# Altium schematic sheet park-contor-12i.SchDoc
size A3; SPICEModelCacheRLVYLVLF: <root> / <DocumentId>RLVYLVLF</DocumentId> / <CacheFrame Number="0"> / <Model Name="led2" Kind="MDL"> / <Text>*Typ RED,GREEN,YELLOW,AMBER GaAs LED: Vf=2.1V Vr=4V If=40mA trr=3uS / *LED Pinout: 1=A, 2=K / .MODEL LED2 D (IS=93.1P RS=42M N=4.61 BV=4 IBV=10U / + CJO=2.97P VJ=.75 M=.333 TT=4.32U)</Text> / </Model> / <Model Name="qnpn" Kind="MDL"> / <Text>*QNPN / *NPN Trans Pinout: C,B,E / .MODEL QNPN NPN(IS=3.2E-16 BF=141 VAF=35 ISE=2.6 NE=1.46 CJE=1E-13 / + MJE=0.333 TF=6E-11 CJC=1E-13 CJS=2.2E-13 MJS=0.5 FC=0.67 )</Text> / </Model> / </CacheFrame> / </root>
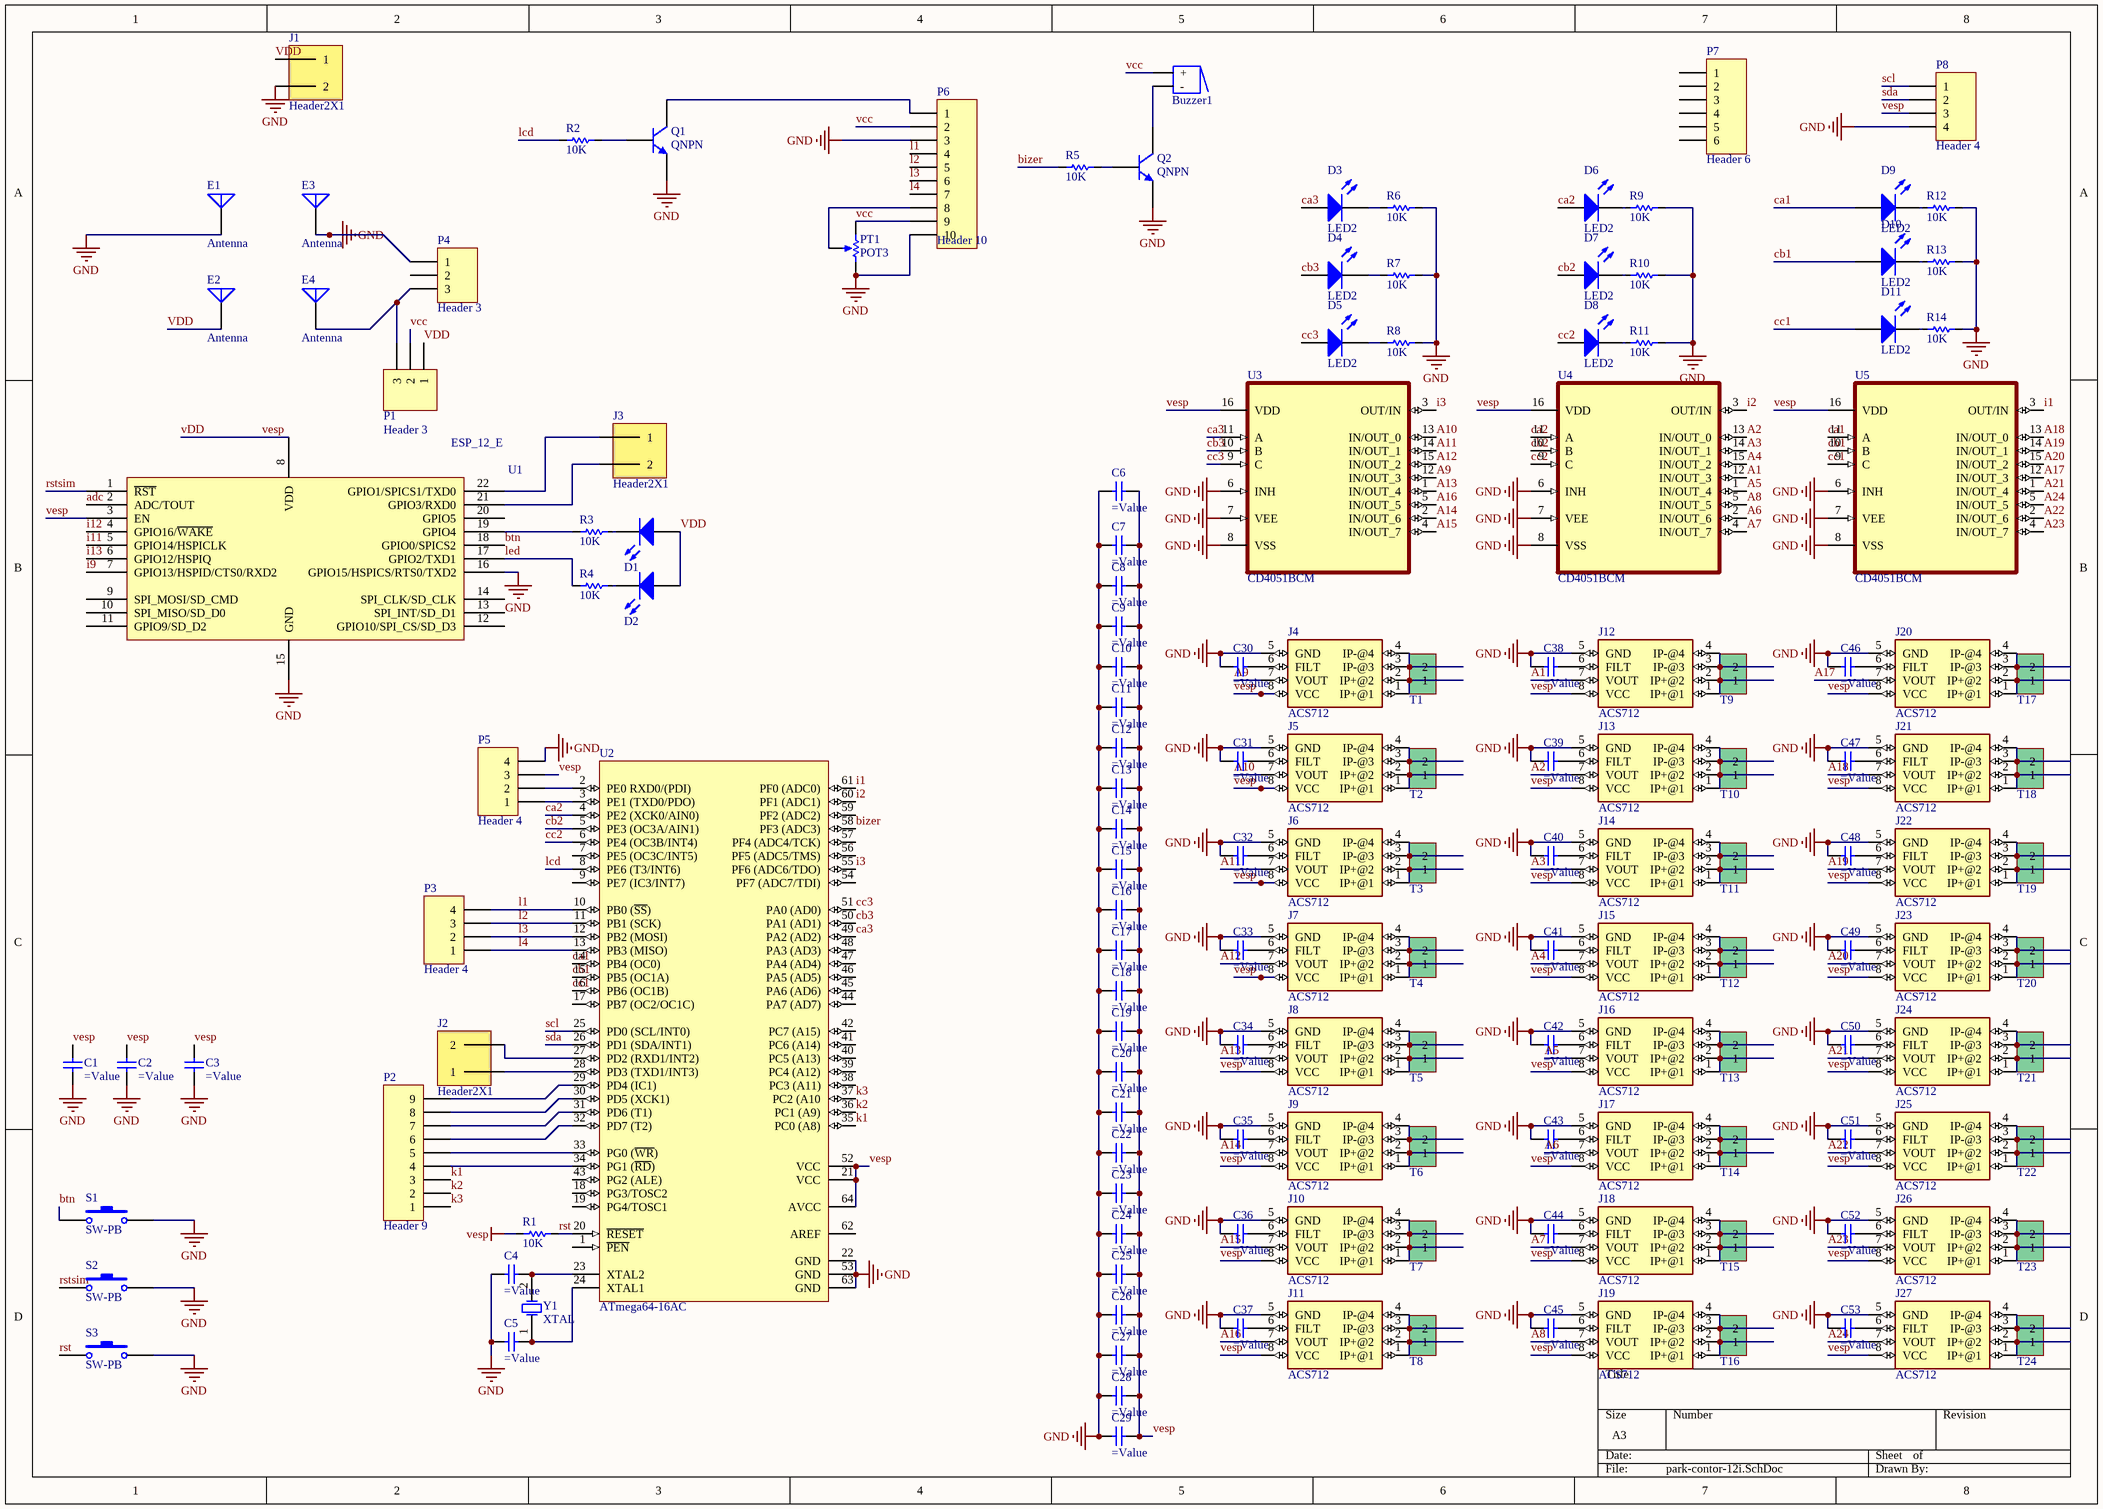
[diagram p0: park-contor-12i.SchDoc]

## Parts
Buzzer1  Buzzer  [BUZZER]  (value not drawn)
C1  (no value)  [CAP 1206]
C2  (no value)  [CAP 1206]
C3  (no value)  [CAP 1206]
C4  (no value)  [CAP 1206]
C5  (no value)  [CAP 1206]
C6  (no value)  [CAP 1206]
C7  (no value)  [CAP 1206]
C8  (no value)  [CAP 1206]
C9  (no value)  [CAP 1206]
C10  (no value)  [CAP 1206]
C11  (no value)  [CAP 1206]
C12  (no value)  [CAP 1206]
C13  (no value)  [CAP 1206]
C14  (no value)  [CAP 1206]
C15  (no value)  [CAP 1206]
C16  (no value)  [CAP 1206]
C17  (no value)  [CAP 1206]
C18  (no value)  [CAP 1206]
C19  (no value)  [CAP 1206]
C20  (no value)  [CAP 1206]
C21  (no value)  [CAP 1206]
C22  (no value)  [CAP 1206]
C23  (no value)  [CAP 1206]
C24  (no value)  [CAP 1206]
C25  (no value)  [CAP 1206]
C26  (no value)  [CAP 1206]
C27  (no value)  [CAP 1206]
C28  (no value)  [CAP 1206]
C29  (no value)  [CAP 1206]
C30  (no value)  [CAP 1206]
C31  (no value)  [CAP 1206]
C32  (no value)  [CAP 1206]
C33  (no value)  [CAP 1206]
C34  (no value)  [CAP 1206]
C35  (no value)  [CAP 1206]
C36  (no value)  [CAP 1206]
C37  (no value)  [CAP 1206]
C38  (no value)  [CAP 1206]
C39  (no value)  [CAP 1206]
C40  (no value)  [CAP 1206]
C41  (no value)  [CAP 1206]
C42  (no value)  [CAP 1206]
C43  (no value)  [CAP 1206]
C44  (no value)  [CAP 1206]
C45  (no value)  [CAP 1206]
C46  (no value)  [CAP 1206]
C47  (no value)  [CAP 1206]
C48  (no value)  [CAP 1206]
C49  (no value)  [CAP 1206]
C50  (no value)  [CAP 1206]
C51  (no value)  [CAP 1206]
C52  (no value)  [CAP 1206]
C53  (no value)  [CAP 1206]
D1  LED 5mm  [LED-1]  (value not drawn)
D2  LED 5mm  [LED-1]  (value not drawn)
D3  LED2  [3.2X1.6X1.1]
D4  LED2  [3.2X1.6X1.1]
D5  LED2  [3.2X1.6X1.1]
D6  LED2  [3.2X1.6X1.1]
D7  LED2  [3.2X1.6X1.1]
D8  LED2  [3.2X1.6X1.1]
D9  LED2  [3.2X1.6X1.1]
D10  LED2  [3.2X1.6X1.1]
D11  LED2  [3.2X1.6X1.1]
E1  Antenna  [PIN1]
E2  Antenna  [PIN1]
E3  Antenna  [PIN1]
E4  Antenna  [PIN1]
J1  Header2X1  [Header 2X1]
J2  Header2X1  [Header 2X1]
J3  Header2X1  [Header 2X1]
J4  ACS712  [SO08]
J5  ACS712  [SO08]
J6  ACS712  [SO08]
J7  ACS712  [SO08]
J8  ACS712  [SO08]
J9  ACS712  [SO08]
J10  ACS712  [SO08]
J11  ACS712  [SO08]
J12  ACS712  [SO08]
J13  ACS712  [SO08]
J14  ACS712  [SO08]
J15  ACS712  [SO08]
J16  ACS712  [SO08]
J17  ACS712  [SO08]
J18  ACS712  [SO08]
J19  ACS712  [SO08]
J20  ACS712  [SO08]
J21  ACS712  [SO08]
J22  ACS712  [SO08]
J23  ACS712  [SO08]
J24  ACS712  [SO08]
J25  ACS712  [SO08]
J26  ACS712  [SO08]
J27  ACS712  [SO08]
P1  Header 3  [HDR1X3]
P2  Header 9  [HDR1X9]
P3  Header 4  [HDR1X4]
P4  Header 3  [HDR1X3]
P5  Header 4  [HDR1X4]
P6  Header 10  [HDR1X10]
P7  Header 6  [HDR1X6]
P8  Header 4  [HDR1X4]
PT1  POT3  [POT3]
Q1  QNPN  [SOT-23B_L]
Q2  QNPN  [SOT-23B_L]
R1  10K  [RES 1206 (3216X08L)]
R2  10K  [RES 1206 (3216X08L)]
R3  10K  [RES 1206 (3216X08L)]
R4  10K  [RES 1206 (3216X08L)]
R5  10K  [RES 1206 (3216X08L)]
R6  10K  [RES 0805 (2012X06L)]
R7  10K  [RES 0805 (2012X06L)]
R8  10K  [RES 0805 (2012X06L)]
R9  10K  [RES 0805 (2012X06L)]
R10  10K  [RES 0805 (2012X06L)]
R11  10K  [RES 0805 (2012X06L)]
R12  10K  [RES 0805 (2012X06L)]
R13  10K  [RES 0805 (2012X06L)]
R14  10K  [RES 0805 (2012X06L)]
S1  SW-PB  [SPST-2]
S2  SW-PB  [SPST-2]
S3  SW-PB  [SPST-2]
T1  Phoenix terminal  [phoenix terminal 2]  (value not drawn)
T2  Phoenix terminal  [phoenix terminal 2]  (value not drawn)
T3  Phoenix terminal  [phoenix terminal 2]  (value not drawn)
T4  Phoenix terminal  [phoenix terminal 2]  (value not drawn)
T5  Phoenix terminal  [phoenix terminal 2]  (value not drawn)
T6  Phoenix terminal  [phoenix terminal 2]  (value not drawn)
T7  Phoenix terminal  [phoenix terminal 2]  (value not drawn)
T8  Phoenix terminal  [phoenix terminal 2]  (value not drawn)
T9  Phoenix terminal  [phoenix terminal 2]  (value not drawn)
T10  Phoenix terminal  [phoenix terminal 2]  (value not drawn)
T11  Phoenix terminal  [phoenix terminal 2]  (value not drawn)
T12  Phoenix terminal  [phoenix terminal 2]  (value not drawn)
T13  Phoenix terminal  [phoenix terminal 2]  (value not drawn)
T14  Phoenix terminal  [phoenix terminal 2]  (value not drawn)
T15  Phoenix terminal  [phoenix terminal 2]  (value not drawn)
T16  Phoenix terminal  [phoenix terminal 2]  (value not drawn)
T17  Phoenix terminal  [phoenix terminal 2]  (value not drawn)
T18  Phoenix terminal  [phoenix terminal 2]  (value not drawn)
T19  Phoenix terminal  [phoenix terminal 2]  (value not drawn)
T20  Phoenix terminal  [phoenix terminal 2]  (value not drawn)
T21  Phoenix terminal  [phoenix terminal 2]  (value not drawn)
T22  Phoenix terminal  [phoenix terminal 2]  (value not drawn)
T23  Phoenix terminal  [phoenix terminal 2]  (value not drawn)
T24  Phoenix terminal  [phoenix terminal 2]  (value not drawn)
U1  ESP_12_E  [ESP_12_E]
U2  ATmega64-16AC  [64A_N]
U3  CD4051BCM  [SOIC127P600X175-16N]
U4  CD4051BCM  [SOIC127P600X175-16N]
U5  CD4051BCM  [SOIC127P600X175-16N]
Y1  XTAL  [R38]

## Nets
GND: C1.2(-) C2.2(-) C3.2(-) C4.2(-) C5.2(-) C6.1(+) C7.1(+) C8.1(+) C9.1(+) C10.1(+) C11.1(+) C12.1(+) C13.1(+) C14.1(+) C15.1(+) C16.1(+) C17.1(+) C18.1(+) C19.1(+) C20.1(+) C21.1(+) C22.1(+) C23.1(+) C24.1(+) C25.1(+) C26.1(+) C27.1(+) C28.1(+) C29.1(+) C30.1(+) C31.1(+) C32.1(+) C33.1(+) C34.1(+) C35.1(+) C36.1(+) C37.1(+) C38.1(+) C39.1(+) C40.1(+) C41.1(+) C42.1(+) C43.1(+) C44.1(+) C45.1(+) C46.1(+) C47.1(+) C48.1(+) C49.1(+) C50.1(+) C51.1(+) C52.1(+) C53.1(+) E1.1(A) E3.1(A) J1.2 J4.5(GND) J5.5(GND) J6.5(GND) J7.5(GND) J8.5(GND) J9.5(GND) J10.5(GND) J11.5(GND) J12.5(GND) J13.5(GND) J14.5(GND) J15.5(GND) J16.5(GND) J17.5(GND) J18.5(GND) J19.5(GND) J20.5(GND) J21.5(GND) J22.5(GND) J23.5(GND) J24.5(GND) J25.5(GND) J26.5(GND) J27.5(GND) P4.1 P5.4 P6.3 P6.10 P8.4 PT1.2(BOT) Q1.3(E) Q2.3(E) R6.2 R7.2 R8.2 R9.2 R10.2 R11.2 R12.2 R13.2 R14.2 S1.2 S2.2 S3.2 U1.15(GND) U1.16(GPIO15/HSPICS/RTS0/TXD2) U2.22(GND) U2.53(GND) U2.63(GND) U3.6(INH) U3.7(VEE) U3.8(VSS) U4.6(INH) U4.7(VEE) U4.8(VSS) U5.6(INH) U5.7(VEE) U5.8(VSS)
vDD: C1.1(+) C2.1(+) C3.1(+) C6.2(-) C7.2(-) C8.2(-) C9.2(-) C10.2(-) C11.2(-) C12.2(-) C13.2(-) C14.2(-) C15.2(-) C16.2(-) C17.2(-) C18.2(-) C19.2(-) C20.2(-) C21.2(-) C22.2(-) C23.2(-) C24.2(-) C25.2(-) C26.2(-) C27.2(-) C28.2(-) C29.2(-) D1.1(A) D2.1(A) E2.1(A) J1.1 J4.8(VCC) J5.8(VCC) J6.8(VCC) J7.8(VCC) J8.8(VCC) J9.8(VCC) J10.8(VCC) J11.8(VCC) J12.8(VCC) J13.8(VCC) J14.8(VCC) J15.8(VCC) J16.8(VCC) J17.8(VCC) J18.8(VCC) J19.8(VCC) J20.8(VCC) J21.8(VCC) J22.8(VCC) J23.8(VCC) J24.8(VCC) J25.8(VCC) J26.8(VCC) J27.8(VCC) P1.1 P5.3 P8.3 R1.2 U1.3(EN) U1.8(VDD) U2.21(VCC) U2.52(VCC) U2.64(AVCC) U3.16(VDD) U4.16(VDD) U5.16(VDD)  [also labelled vesp]
A1: J12.7(VOUT) U4.12(IN/OUT_3)
A2: J13.7(VOUT) U4.13(IN/OUT_0)
A3: J14.7(VOUT) U4.14(IN/OUT_1)
A4: J15.7(VOUT) U4.15(IN/OUT_2)
A5: J16.7(VOUT) U4.1(IN/OUT_4)
A6: J17.7(VOUT) U4.2(IN/OUT_6)
A7: J18.7(VOUT) U4.4(IN/OUT_7)
A8: J19.7(VOUT) U4.5(IN/OUT_5)
A9: J4.7(VOUT) U3.12(IN/OUT_3)
A10: J5.7(VOUT) U3.13(IN/OUT_0)
A11: J6.7(VOUT) U3.14(IN/OUT_1)
A12: J7.7(VOUT) U3.15(IN/OUT_2)
A13: J8.7(VOUT) U3.1(IN/OUT_4)
A14: J9.7(VOUT) U3.2(IN/OUT_6)
A15: J10.7(VOUT) U3.4(IN/OUT_7)
A16: J11.7(VOUT) U3.5(IN/OUT_5)
A17: J20.7(VOUT) U5.12(IN/OUT_3)
A18: J21.7(VOUT) U5.13(IN/OUT_0)
A19: J22.7(VOUT) U5.14(IN/OUT_1)
A20: J23.7(VOUT) U5.15(IN/OUT_2)
A21: J24.7(VOUT) U5.1(IN/OUT_4)
A22: J25.7(VOUT) U5.2(IN/OUT_6)
A23: J26.7(VOUT) U5.4(IN/OUT_7)
A24: J27.7(VOUT) U5.5(IN/OUT_5)
adc: U1.2(ADC/TOUT)
bizer: R5.1 U2.58(PF3_(ADC3))
btn: S1.1 U1.18(GPIO0/SPICS2)
ca1: D9.1(A) U2.14(PB4_(OC0)) U5.11(A)
ca2: D6.1(A) U2.4(PE2_(XCK0/AIN0)) U4.11(A)
ca3: D3.1(A) U2.49(PA2_(AD2)) U3.11(A)
cb1: D10.1(A) U2.15(PB5_(OC1A)) U5.10(B)
cb2: D7.1(A) U2.5(PE3_(OC3A/AIN1)) U4.10(B)
cb3: D4.1(A) U2.50(PA1_(AD1)) U3.10(B)
cc1: D11.1(A) U2.16(PB6_(OC1B)) U5.9(C)
cc2: D8.1(A) U2.6(PE4_(OC3B/INT4)) U4.9(C)
cc3: D5.1(A) U2.51(PA0_(AD0)) U3.9(C)
i1: U2.61(PF0_(ADC0)) U5.3(OUT/IN)
i2: U2.60(PF1_(ADC1)) U4.3(OUT/IN)
i3: U2.55(PF6_(ADC6/TDO)) U3.3(OUT/IN)
i9: U1.7(GPIO13/HSPID/CTS0/RXD2)
i11: U1.5(GPIO14/HSPICLK)
i12: U1.4(GPIO16/~{WAKE})
i13: U1.6(GPIO12/HSPIQ)
k1: P2.3 U2.35(PC0_(A8))
k2: P2.2 U2.36(PC1_(A9))
k3: P2.1 U2.37(PC2_(A10)
l1: P3.4 P6.4 U2.10(PB0_(~{SS}))
l2: P3.3 P6.5 U2.11(PB1_(SCK))
l3: P3.2 P6.6 U2.12(PB2_(MOSI))
l4: P3.1 P6.7 U2.13(PB3_(MISO))
lcd: R2.1 U2.8(PE6_(T3/INT6))
led: R4.1 U1.17(GPIO2/TXD1)
rst: R1.1 S3.1 U2.20(~{RESET})
rstsim: S2.1 U1.1(~{RST})
scl: P8.1 U2.25(PD0_(SCL/INT0))
sda: P8.2 U2.26(PD1_(SDA/INT1))
vcc: Buzzer1.1(+) P1.2 P6.2 P6.9 PT1.1(TOP)
NetBuzzer1_2: Buzzer1.2(-) Q2.1(C)
NetC4_1: C4.1(+) U2.23(XTAL2) Y1.2(OSC2)
NetC5_1: C5.1(+) U2.24(XTAL1) Y1.1(OSC1)
NetC30_2: C30.2(-) J4.6(FILT)
NetC31_2: C31.2(-) J5.6(FILT)
NetC32_2: C32.2(-) J6.6(FILT)
NetC33_2: C33.2(-) J7.6(FILT)
NetC34_2: C34.2(-) J8.6(FILT)
NetC35_2: C35.2(-) J9.6(FILT)
NetC36_2: C36.2(-) J10.6(FILT)
NetC37_2: C37.2(-) J11.6(FILT)
NetC38_2: C38.2(-) J12.6(FILT)
NetC39_2: C39.2(-) J13.6(FILT)
NetC40_2: C40.2(-) J14.6(FILT)
NetC41_2: C41.2(-) J15.6(FILT)
NetC42_2: C42.2(-) J16.6(FILT)
NetC43_2: C43.2(-) J17.6(FILT)
NetC44_2: C44.2(-) J18.6(FILT)
NetC45_2: C45.2(-) J19.6(FILT)
NetC46_2: C46.2(-) J20.6(FILT)
NetC47_2: C47.2(-) J21.6(FILT)
NetC48_2: C48.2(-) J22.6(FILT)
NetC49_2: C49.2(-) J23.6(FILT)
NetC50_2: C50.2(-) J24.6(FILT)
NetC51_2: C51.2(-) J25.6(FILT)
NetC52_2: C52.2(-) J26.6(FILT)
NetC53_2: C53.2(-) J27.6(FILT)
NetD1_2: D1.2(K) R3.2
NetD2_2: D2.2(K) R4.2
NetD3_2: D3.2(K) R6.1
NetD4_2: D4.2(K) R7.1
NetD5_2: D5.2(K) R8.1
NetD6_2: D6.2(K) R9.1
NetD7_2: D7.2(K) R10.1
NetD8_2: D8.2(K) R11.1
NetD9_2: D9.2(K) R12.1
NetD10_2: D10.2(K) R13.1
NetD11_2: D11.2(K) R14.1
NetE4_1: E4.1(A) P1.3 P4.3
NetJ2_1: J2.1 U2.28(PD3_(TXD1/INT3))
NetJ2_2: J2.2 U2.27(PD2_(RXD1/INT2))
NetJ3_1: J3.1 U1.22(GPIO1/SPICS1/TXD0)
NetJ3_2: J3.2 U1.21(GPIO3/RXD0)
NetJ4_1: J4.1(IP+@1) J4.2(IP+@2) T1.1
NetJ4_3: J4.3(IP-@3) J4.4(IP-@4) T1.2
NetJ5_1: J5.1(IP+@1) J5.2(IP+@2) T2.1
NetJ5_3: J5.3(IP-@3) J5.4(IP-@4) T2.2
NetJ6_1: J6.1(IP+@1) J6.2(IP+@2) T3.1
NetJ6_3: J6.3(IP-@3) J6.4(IP-@4) T3.2
NetJ7_1: J7.1(IP+@1) J7.2(IP+@2) T4.1
NetJ7_3: J7.3(IP-@3) J7.4(IP-@4) T4.2
NetJ8_1: J8.1(IP+@1) J8.2(IP+@2) T5.1
NetJ8_3: J8.3(IP-@3) J8.4(IP-@4) T5.2
NetJ9_1: J9.1(IP+@1) J9.2(IP+@2) T6.1
NetJ9_3: J9.3(IP-@3) J9.4(IP-@4) T6.2
NetJ10_1: J10.1(IP+@1) J10.2(IP+@2) T7.1
NetJ10_3: J10.3(IP-@3) J10.4(IP-@4) T7.2
NetJ11_1: J11.1(IP+@1) J11.2(IP+@2) T8.1
NetJ11_3: J11.3(IP-@3) J11.4(IP-@4) T8.2
NetJ12_1: J12.1(IP+@1) J12.2(IP+@2) T9.1
NetJ12_3: J12.3(IP-@3) J12.4(IP-@4) T9.2
NetJ13_1: J13.1(IP+@1) J13.2(IP+@2) T10.1
NetJ13_3: J13.3(IP-@3) J13.4(IP-@4) T10.2
NetJ14_1: J14.1(IP+@1) J14.2(IP+@2) T11.1
NetJ14_3: J14.3(IP-@3) J14.4(IP-@4) T11.2
NetJ15_1: J15.1(IP+@1) J15.2(IP+@2) T12.1
NetJ15_3: J15.3(IP-@3) J15.4(IP-@4) T12.2
NetJ16_1: J16.1(IP+@1) J16.2(IP+@2) T13.1
NetJ16_3: J16.3(IP-@3) J16.4(IP-@4) T13.2
NetJ17_1: J17.1(IP+@1) J17.2(IP+@2) T14.1
NetJ17_3: J17.3(IP-@3) J17.4(IP-@4) T14.2
NetJ18_1: J18.1(IP+@1) J18.2(IP+@2) T15.1
NetJ18_3: J18.3(IP-@3) J18.4(IP-@4) T15.2
NetJ19_1: J19.1(IP+@1) J19.2(IP+@2) T16.1
NetJ19_3: J19.3(IP-@3) J19.4(IP-@4) T16.2
NetJ20_1: J20.1(IP+@1) J20.2(IP+@2) T17.1
NetJ20_3: J20.3(IP-@3) J20.4(IP-@4) T17.2
NetJ21_1: J21.1(IP+@1) J21.2(IP+@2) T18.1
NetJ21_3: J21.3(IP-@3) J21.4(IP-@4) T18.2
NetJ22_1: J22.1(IP+@1) J22.2(IP+@2) T19.1
NetJ22_3: J22.3(IP-@3) J22.4(IP-@4) T19.2
NetJ23_1: J23.1(IP+@1) J23.2(IP+@2) T20.1
NetJ23_3: J23.3(IP-@3) J23.4(IP-@4) T20.2
NetJ24_1: J24.1(IP+@1) J24.2(IP+@2) T21.1
NetJ24_3: J24.3(IP-@3) J24.4(IP-@4) T21.2
NetJ25_1: J25.1(IP+@1) J25.2(IP+@2) T22.1
NetJ25_3: J25.3(IP-@3) J25.4(IP-@4) T22.2
NetJ26_1: J26.1(IP+@1) J26.2(IP+@2) T23.1
NetJ26_3: J26.3(IP-@3) J26.4(IP-@4) T23.2
NetJ27_1: J27.1(IP+@1) J27.2(IP+@2) T24.1
NetJ27_3: J27.3(IP-@3) J27.4(IP-@4) T24.2
NetP2_4: P2.4 U2.34(PG1_(~{RD}))
NetP2_5: P2.5 U2.33(PG0_(~{WR}))
NetP2_6: P2.6 U2.32(PD7_(T2))
NetP2_7: P2.7 U2.31(PD6_(T1))
NetP2_8: P2.8 U2.30(PD5_(XCK1))
NetP2_9: P2.9 U2.29(PD4_(IC1))
NetP5_1: P5.1 U2.3(PE1_(TXD0/PDO))
NetP5_2: P5.2 U2.2(PE0_RXD0/(PDI))
NetP6_1: P6.1 Q1.1(C)
NetP6_8: P6.8 PT1.3(TAP)
NetQ1_2: Q1.2(B) R2.2
NetQ2_2: Q2.2(B) R5.2
NetR3_1: R3.1 U1.19(GPIO4)

Not connected (* = marked no-connect by the designer): P4 2; P7 1 2 3 4 5 6; U1 9(SPI_MOSI/SD_CMD) 10(SPI_MISO/SD_D0) 11(GPIO9/SD_D2) 12(GPIO10/SPI_CS/SD_D3) 13(SPI_INT/SD_D1) 14(SPI_CLK/SD_CLK) 20(GPIO5); U2 1(~{PEN}) 7(PE5_(OC3C/INT5)) 9(PE7_(IC3/INT7)) 17(PB7_(OC2/OC1C)) 18(PG3/TOSC2) 19(PG4/TOSC1) 38(PC3_(A11)) 39(PC4_(A12)) 40(PC5_(A13)) 41(PC6_(A14)) 42(PC7_(A15)) 43(PG2_(ALE)) 44(PA7_(AD7)) 45(PA6_(AD6)) 46(PA5_(AD5)) 47(PA4_(AD4)) 48(PA3_(AD3)) 54(PF7_(ADC7/TDI)) 56(PF5_(ADC5/TMS)) 57(PF4_(ADC4/TCK)) 59(PF2_(ADC2)) 62(AREF)

## Library data of the parts
Buzzer1 = Buzzer: Designer: Seyed Mohsen Ghasemain; ComponentLinkURL: www.picpars.com
C1-C53 = Capacitor
D1 D2 = LED 5mm: Typical LED; Designer: Seyed Mohsen Ghasemian; Published: 07/31/2012; PackageReference: LED; Publisher: www.picpars.com; PackageDescription: LED; 2 Leads
D3-D11 = LED2: Typical RED, GREEN, YELLOW, AMBER GaAs LED; Published: 8-Jun-2000; LatestRevisionDate: 17-Jul-2002; LatestRevisionNote: Re-released for DXP Platform.; PackageVersion: Feb-2002; PackageReference: 3.2X1.6X1.1; Publisher: Altium Limited; PackageDescription: SM LED; 2 Flat Leads
E1-E4 = Antenna: Generic Antenna; Published: 24-Mar-1999; LatestRevisionDate: 17-Jul-2002; LatestRevisionNote: Re-released for DXP Platform.; PackageReference: PIN1; Publisher: Altium Limited
J4-J27 = ACS712: Current Sensor 5A 1 Channel Hall Effect, Open Loop Bidirectional 8-SOIC (0.154, 3.90mm Width); MF: Allegro MicroSystems; Availability: In Stock; MP: ACS712; Price: None; Value: *; SnapEDA_Link: https://www.snapeda.com/parts/ACS712/Allegro+MicroSystems+LLC/view-part/?ref=snap; Check_prices: https://www.snapeda.com/parts/ACS712/Allegro+MicroSystems+LLC/view-part/?ref=eda; Package: None
P1 P4 = Header 3: Header, 3-Pin; LatestRevisionDate: 17-Jul-2002; LatestRevisionNote: Re-released for DXP Platform.; Publisher: Altium Limited
P2 = Header 9: Header, 9-Pin; LatestRevisionDate: 17-Jul-2002; LatestRevisionNote: Re-released for DXP Platform.; Publisher: Altium Limited
P3 P5 P8 = Header 4: Header, 4-Pin; LatestRevisionDate: 17-Jul-2002; LatestRevisionNote: Re-released for DXP Platform.; Publisher: Altium Limited
P6 = Header 10: Header, 10-Pin; LatestRevisionDate: 17-Jul-2002; LatestRevisionNote: Re-released for DXP Platform.; Publisher: Altium Limited
P7 = Header 6: Header, 6-Pin; LatestRevisionDate: 17-Jul-2002; LatestRevisionNote: Re-released for DXP Platform.; Publisher: Altium Limited
PT1 = POT3: Variable Potentiometer top adjust; Designer: Seyed Mohsen Ghasemian; WEB: www.picpars.com
Q1 Q2 = QNPN: NPN Bipolar Transistor; pin to pad: 1>3 2>1 3>2; Published: 8-Jun-2000; LatestRevisionDate: 29-May-2009; LatestRevisionNote: IPC-7351 Footprint Added.; PackageVersion: Aug-1999; PackageReference: SOT-23B; Publisher: Altium Limited; PackageDescription: 3-Pin SOT-23 Package 0.95 mm Pitch, 2.4 mm Lead Span
R1-R14 = Resistor: Tolerance: 5%; Power: 1/4 W; Value: 10K
S1-S3 = SW-PB: Switch; Published: 24-Mar-1999; LatestRevisionDate: 17-Jul-2002; LatestRevisionNote: Re-released for DXP Platform.; PackageReference: SPST-2; Publisher: Altium Limited; PackageDescription: Switch; 2 Leads
T1-T24 = Phoenix terminal 2: Terminal 2 Pin; Designer: Seyed Mohsen Ghasemain; E-mail: picpars@gmail.com; ComponentLinkURL: www.picpars.com
U1 = ESP_12_E: ESP-12 Wi-Fi Module by AI-Thinker; IC: ESP8266-EX; Vendor: Ai-thinker
U2 = ATmega64-16AC: 8-Bit AVR Microcontroller with 64K Bytes of In-System Programmable Flash Memory; Published: 17-Sep-2003; LatestRevisionDate: 16-Oct-2006; LatestRevisionNote: IPC-7351 Footprint Added.; DatasheetVersion: 2490C-AVR-009/02; PackageVersion: revB, Oct-2001; PackageReference: 64A; Publisher: Altium Limited; PackageDescription: 64-Pin Plastic Thin Profile Quad Flat Pack, 14 x 14 x 1.0 mm Body, 0.8 mm Pitch (TQFP); Supplier 1: Digi-Key; Supplier Part Number 1: ATMEGA64-16AC-ND; Supplier 2: Mouser; Supplier Part Number 2: 556-ATMEGA64-16AC; Code_JEDEC: MS-026-AEB; ComponentLink1Description: Datasheet; ComponentLink1URL: http://www.atmel.com/dyn/resources/prod_documents/doc2490.pdf; ComponentLink2Description: Atmel.com Home; ComponentLink2URL: http://www.atmel.com
U3-U5 = CD4051BCM: 1 Circuit IC Switch 8:1 240Ohm 16-SOIC; MF: ON Semiconductor; SnapEDA_Link: https://www.snapeda.com/parts/CD4051BCM/ON%20Semiconductor/view-part/2774140/?ref=snap; Availability: Unavailable; Price: None; Package: SOIC-16 Rochester Electronics; MP: CD4051BCM; Value: *
Y1 = XTAL: Crystal Oscillator; Published: 8-Jun-2000; LatestRevisionDate: 17-Jul-2002; LatestRevisionNote: Re-released for DXP Platform.; PackageReference: R38; Publisher: Altium Limited; PackageDescription: Crystal, Thru-Hole; 2 Leads; Body 3.1 x 8.2 mm (Dia.xH)